# Altium schematic sheet l2.schdoc
size 304 x 182 mm
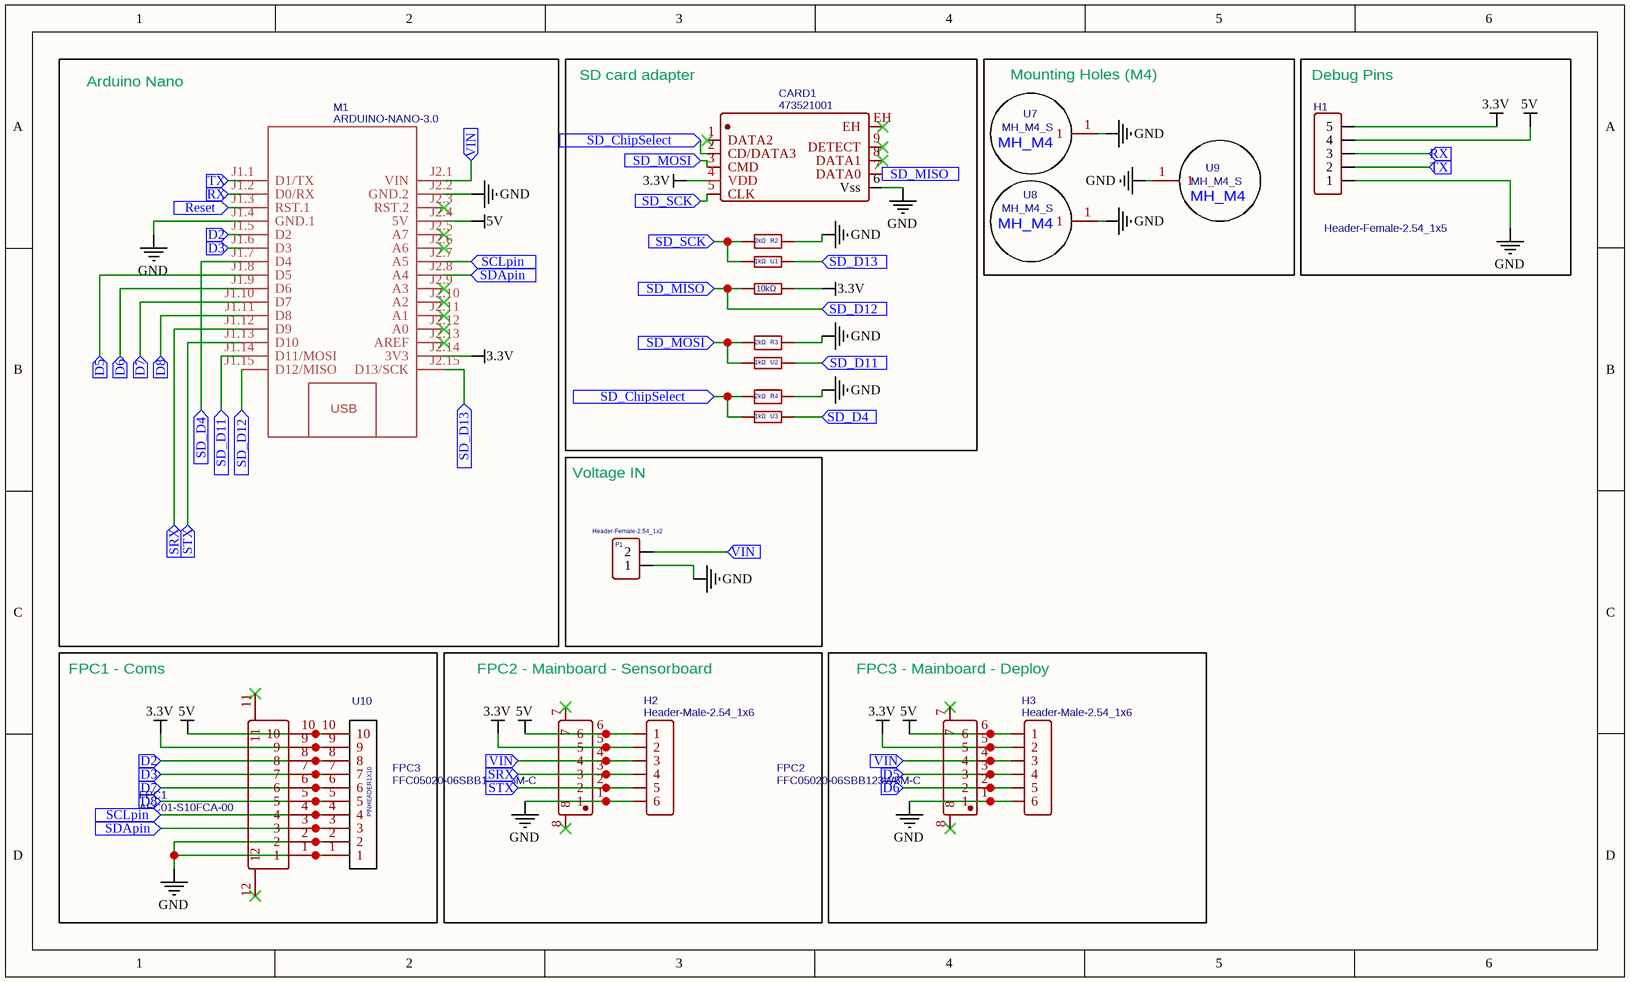
[diagram p0: l2.schdoc]

## Parts
CARD1  473521001  [SD-SMD_SD-47352-101]
FPC1  AFC01-S10FCA-00  [FPC-SMD_P0.5-10P_FGS-XJ-H2.0]
FPC2  FFC05020-06SBB123W5M-C  [FFC-SMD_6P-P0.50_FFC05020-06SBB123W5M]
FPC3  FFC05020-06SBB123W5M-C  [FFC-SMD_6P-P0.50_FFC05020-06SBB123W5M]
H1  Header-Female-2.54_1x5  [HDR-TH_5P-P2.54-V-F]
H2  Header-Male-2.54_1x6  [HDR-TH_6P-P2.54-V-M-1]
H3  Header-Male-2.54_1x6  [HDR-TH_6P-P2.54-V-M-1]
M1  ARDUINO-NANO-3.0  [ARDUINO-NANO-3.0]
P1  Header-Female-2.54_1x2  [HDR-TH_2P-P2.54-V-F]
R1  10kΩ  [R1206]
R2  2kΩ  [R1206]
R3  2kΩ  [R1206]
R4  2kΩ  [R1206]
U1  1kΩ  [R1206]
U2  1kΩ  [R1206]
U3  1kΩ  [R1206]
U7  MH_M4_S  [MH_M4_PCB]
U8  MH_M4_S  [MH_M4_PCB]
U9  MH_M4_S  [MH_M4_PCB]
U10  PINHEADER1X10  [PINHEADER1X10]

## Blocks framed on the sheet
Arduino Nano: M1
SD card adapter: CARD1 R1-R4 U1-U3
Mounting Holes (M4): U7-U9
Debug Pins: H1
Voltage IN: P1
FPC1 - Coms: FPC1 U10
FPC2 - Mainboard - Sensorboard: FPC3 H2
FPC3 - Mainboard - Deploy: FPC2 H3

## Ports
D2 (in), D3 (in), D5 (in), D6 (in), D7 (in), D8 (in), Reset (in), RX (in), SCLpin (in), SD_ChipSelect (in), SD_D4 (in), SD_D11 (in), SD_D12 (in), SD_D13 (in), SD_MISO (in), SD_MOSI (in), SD_SCK (in), SDApin (in), SRX (in), STX (in), TX (in), VIN (in)

## Nets
3.3V: CARD1.4(VDD) FPC1.9 FPC2.5 FPC3.5 H1.5 H2.2 H3.2 M1.J2.14(3V3) R1.2 U10.9
5V: FPC1.10 FPC2.6 FPC3.6 H1.4 H2.1 H3.1 M1.J2.4(5V) U10.10
GND: CARD1.6(Vss) FPC1.1 FPC1.2 FPC2.1 FPC3.1 H1.1 H2.6 H3.6 M1.J1.4(GND.1) M1.J2.2(GND.2) P1.1 R2.2 R3.2 R4.2 U7.1 U8.1 U9.1 U10.1 U10.2
D2: FPC1.8 M1.J1.5(D2) U10.8 ; port D2
D3: FPC1.7 M1.J1.6(D3) U10.7 ; port D3
D5: FPC2.3 H3.4 M1.J1.8(D5) ; port D5
D6: FPC2.2 H3.5 M1.J1.9(D6) ; port D6
D7: FPC1.6 M1.J1.10(D7) U10.6 ; port D7
D8: FPC1.5 M1.J1.11(D8) U10.5 ; port D8
Reset: M1.J1.3(RST.1) ; port Reset
RX: H1.3 M1.J1.2(D0/RX) ; port RX
SCLpin: FPC1.4 M1.J2.7(A5) U10.4 ; port SCLpin
SD_ChipSelect: CARD1.2(CD/DATA3) R4.1 U3.1 ; port SD_ChipSelect
SD_D4: M1.J1.7(D4) U3.2 ; port SD_D4
SD_D11: M1.J1.14(D11/MOSI) U2.2 ; port SD_D11
SD_D12: CARD1.7(DATA0) M1.J1.15(D12/MISO) R1.1 ; port SD_D12, port SD_MISO
SD_D13: M1.J2.15(D13/SCK) U1.2 ; port SD_D13
SD_MOSI: CARD1.3(CMD) R3.1 U2.1 ; port SD_MOSI
SD_SCK: CARD1.5(CLK) R2.1 U1.1 ; port SD_SCK
SDApin: FPC1.3 M1.J2.8(A4) U10.3 ; port SDApin
SRX: FPC3.3 H2.4 M1.J1.12(D9) ; port SRX
STX: FPC3.2 H2.5 M1.J1.13(D10) ; port STX
TX: H1.2 M1.J1.1(D1/TX) ; port TX
VIN: FPC2.4 FPC3.4 H2.3 H3.3 M1.J2.1(VIN) P1.2 ; port VIN

Not connected (* = marked no-connect by the designer): CARD1 1(DATA2)* 8(DATA1)* 9(DETECT)* EH*; FPC1 11* 12*; FPC2 7* 8*; FPC3 7* 8*; M1 J2.3(RST.2)* J2.5(A7)* J2.6(A6)* J2.9(A3)* J2.10(A2)* J2.11(A1)* J2.12(A0)* J2.13(AREF)*

## Notes on the sheet
- (in symbol ARDUINO-NANO-3.0) USB
- (in symbol MH_M4_S) MH_M4

## Library data of the parts
CARD1 = 473521001: Manufacturer: MOLEX; Contributor: LCSC; Supplier: LCSC; Supplier Part: C293569; Manufacturer Part: 473521001; JLCPCB Part Class: Extended Part; spicePre: C; spiceSymbolName: 473521001
FPC1 = AFC01-S10FCA-00: Manufacturer: JS(钜硕电子); Contributor: LCSC; Supplier: LCSC; Supplier Part: C262659; Manufacturer Part: AFC01-S10FCA-00; JLCPCB Part Class: Extended Part; spicePre: F; spiceSymbolName: AFC01-S10FCA-00
FPC2 FPC3 = FFC05020-06SBB123W5M-C: Manufacturer: TXGA(特思嘉); Contributor: LCSC; Supplier: LCSC; Supplier Part: C456448; Manufacturer Part: FFC05020-06SBB123W5M-C; JLCPCB Part Class: Extended Part; spicePre: F; spiceSymbolName: FFC05020-06SBB123W5M-C
H1 = Header-Female-2.54_1x5: Manufacturer: BOOMELE(博穆精密); Manufacturer Part: 2.54-1*5P母; Supplier: LCSC; Supplier Part: C50950; JLCPCB Part Class: Extended Part; spicePre: H; spiceSymbolName: Header-Female-2.54_1x5
H2 H3 = Header-Male-2.54_1x6: Manufacturer: BOOMELE(博穆精密); Manufacturer Part: 2.54-1x6P直针; Supplier: LCSC; Supplier Part: C37208; JLCPCB Part Class: Extended Part; spicePre: H; spiceSymbolName: Header-Male-2.54_1x6
M1 = ARDUINO-NANO-3.0: Contributor: sirapat pholwa; spicePre: M; spiceSymbolName: ARDUINO-NANO-3.0
P1 = Header-Female-2.54_1x2: Manufacturer: BOOMELE(博穆精密); Manufacturer Part: 2.54-1*2P母; Supplier: LCSC; Supplier Part: C49661; JLCPCB Part Class: Extended Part; spicePre: P; spiceSymbolName: Header-Female-2.54_1x2
R1 = 10kΩ: Manufacturer: VISHAY(威世); Manufacturer Part: CRCW120610K0FKEA; nameAlias: Value; Contributor: LCSC; Supplier: LCSC; Supplier Part: C242483; JLCPCB Part Class: Extended Part; spicePre: R; spiceSymbolName: CRCW120610K0FKEA
R2-R4 = 2kΩ: Manufacturer: VO(翔胜); Manufacturer Part: 1206 ±1% 2K; nameAlias: Value; Contributor: lcsc; Supplier: LCSC; Supplier Part: C2889681; JLCPCB Part Class: Extended Part; spicePre: R; spiceSymbolName: 1206 ±1% 2K
U1-U3 = 1kΩ: Manufacturer: EVER OHMS(天二科技); Manufacturer Part: HR1206J1K00P05Z; Contributor: LCSC; nameAlias: Value; Supplier: LCSC; Supplier Part: C175514; JLCPCB Part Class: Extended Part; spicePre: U; spiceSymbolName: HR1206J1KP05
U7-U9 = MH_M4_S: Contributor: js314dev; spicePre: U; spiceSymbolName: MH_M4_S
U10 = PINHEADER1X10: Contributor: sorza102; Supplier Part: undefined; spicePre: U; spiceSymbolName: PINHEADER1X10